# EAGLE schematic Mtx6BR_V2 (EAGLE 7.5.0)
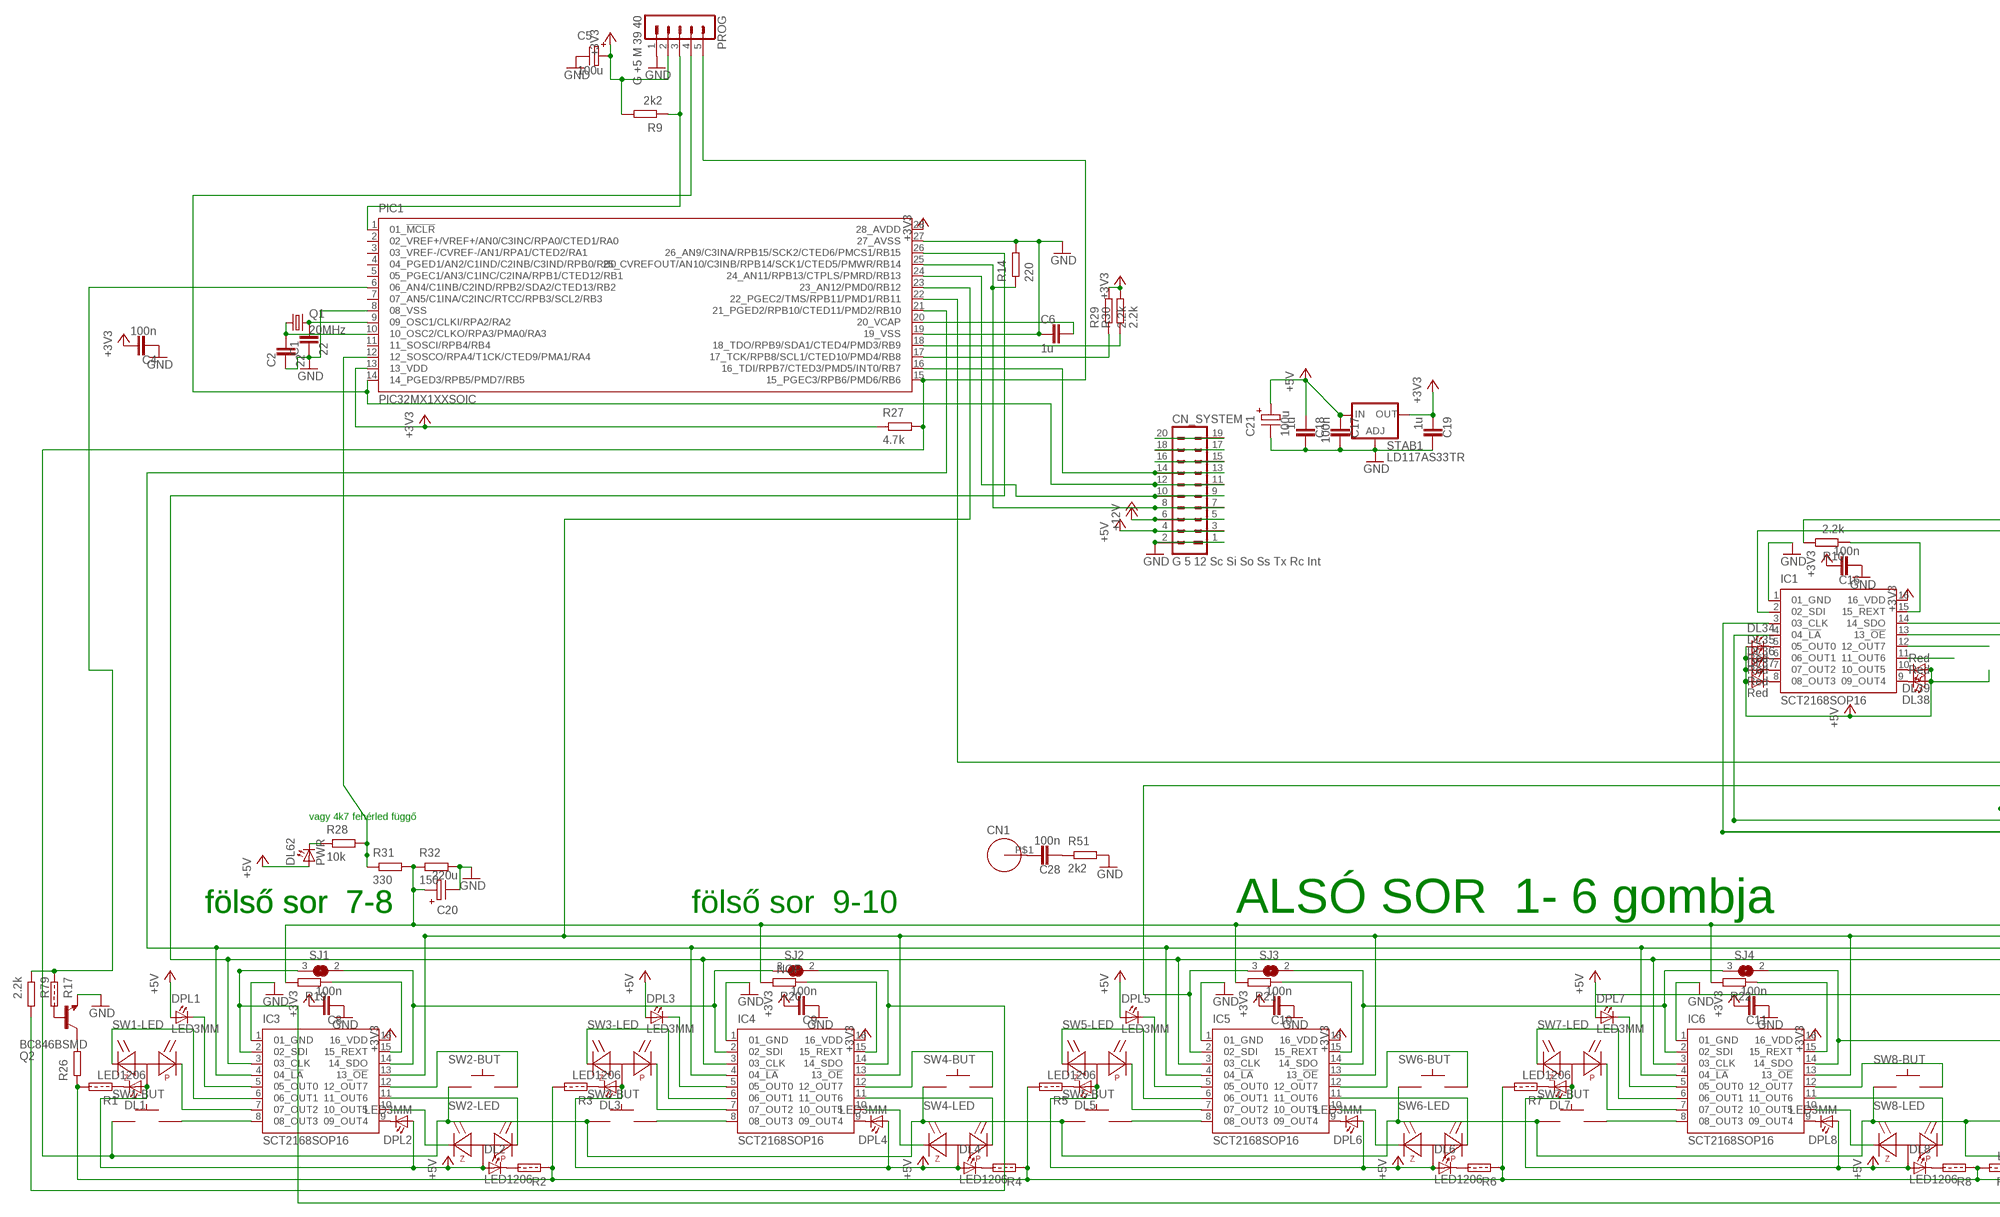
[diagram p0: schematic, sheet 1, part 1 of 2]
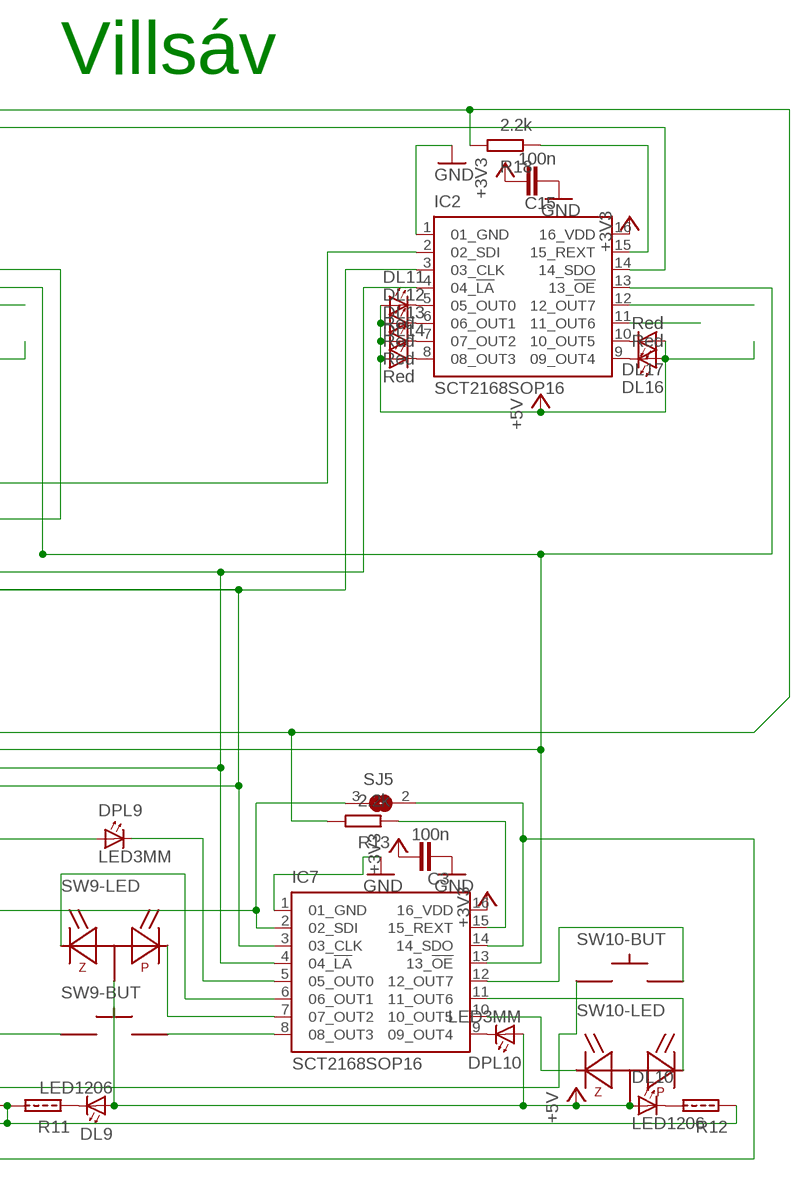
[diagram p1: schematic, sheet 1, part 2 of 2]

## Parts
C1  22  C0805  [R0805]
C2  22  C0805  [R0805]
C3  100n  C0805  [R0805]
C4  100n  C0805  [R0805]
C5  100u  C_EL1R07  [C_EL1RASZT07]
C6  1u  C0805  [R0805]
C8  100n  C0805  [R0805]
C9  100n  C0805  [R0805]
C10  100n  C0805  [R0805]
C11  100n  C0805  [R0805]
C15  100n  C0805  [R0805]
C16  100n  C0805  [R0805]
C17  100n  C0805  [R0805]
C18  1u  C0805  [R0805]
C19  1u  C0805  [R0805]
C20  220u  C_EL1R07  [C_EL1RASZT07]
C21  100u  C_EL1R07  [C_EL1RASZT07]
C28  100n  C0805  [R0805]
CN1  TESTCSAVAR3.5  [TESTCSAVAR_3.5]
CN_SYSTEM  G 5 12 Sc Si So Ss Tx Rc Int  PIN10_2  [PIN10_2]
DL1  LED1206  [R1206]
DL2  LED1206  [R1206]
DL3  LED1206  [R1206]
DL4  LED1206  [R1206]
DL5  LED1206  [R1206]
DL6  LED1206  [R1206]
DL7  LED1206  [R1206]
DL8  LED1206  [R1206]
DL9  LED1206  [R1206]
DL10  LED1206  [R1206]
DL11  Red  LED5MM  [LED5MM]
DL12  Red  LED5MM  [LED5MM]
DL13  Red  LED5MM  [LED5MM]
DL14  Red  LED5MM  [LED5MM]
DL16  Red  LED5MM  [LED5MM]
DL17  Red  LED5MM  [LED5MM]
DL34  Red  LED5MM  [LED5MM]
DL35  Red  LED5MM  [LED5MM]
DL36  Red  LED5MM  [LED5MM]
DL37  Red  LED5MM  [LED5MM]
DL38  Red  LED5MM  [LED5MM]
DL39  Red  LED5MM  [LED5MM]
DL62  PWR  LED5MM  [LED5MM]
DPL1  LED3MM  [LED3MM]
DPL2  LED3MM  [LED3MM]
DPL3  LED3MM  [LED3MM]
DPL4  LED3MM  [LED3MM]
DPL5  LED3MM  [LED3MM]
DPL6  LED3MM  [LED3MM]
DPL7  LED3MM  [LED3MM]
DPL8  LED3MM  [LED3MM]
DPL9  LED3MM  [LED3MM]
DPL10  LED3MM  [LED3MM]
IC1  SCT2168SOP16  [SO16]
IC2  SCT2168SOP16  [SO16]
IC3  SCT2168SOP16  [SO16]
IC4  SCT2168SOP16  [SO16]
IC5  SCT2168SOP16  [SO16]
IC6  SCT2168SOP16  [SO16]
IC7  SCT2168SOP16  [SO16]
PIC1  PIC32MX1XXSOIC  [SOIC127P1032X265-28N]
PROG  G +5 M 39 40  PIN05_1  [PIN05_1]
Q1  20MHz  XTAL_2NAGYSMD  [XTAL_NAGYSMD]
Q2  BC846BSMD  [SOT23]
R1  RNULL_EU0805  [R0805_C]
R2  RNULL_EU0805  [R0805_C]
R3  RNULL_EU0805  [R0805_C]
R4  RNULL_EU0805  [R0805_C]
R5  RNULL_EU0805  [R0805_C]
R6  RNULL_EU0805  [R0805_C]
R7  RNULL_EU0805  [R0805_C]
R8  RNULL_EU0805  [R0805_C]
R9  2k2  R_EU0805  [R0805]
R10  2.2k  R_EU0805  [R0805]
R11  RNULL_EU0805  [R0805_C]
R12  RNULL_EU0805  [R0805_C]
R13  2.2k  R_EU0805  [R0805]
R14  220  R_EU0805  [R0805]
R17  RNULL_EU0805  [R0805_C]
R18  2.2k  R_EU0805  [R0805]
R19  R_EU0805  [R0805]
R20  NOP  R_EU0805  [R0805]
R21  R_EU0805  [R0805]
R22  R_EU0805  [R0805]
R26  R_EU0805  [R0805]
R27  4.7k  R_EU0805  [R0805]
R28  10k  R_EU0805  [R0805]
R29  2.2k  R_EU0805  [R0805]
R30  2.2k  R_EU0805  [R0805]
R31  330  R_EU0805  [R0805]
R32  150  R_EU0805  [R0805]
R51  2k2  R_EU0805  [R0805]
R79  2.2k  R_EU0805  [R0805]
SJ1  SJ  [SJ]
SJ2  SJ  [SJ]
SJ3  SJ  [SJ]
SJ4  SJ  [SJ]
SJ5  SJ  [SJ]
STAB1  LD117AS33TR  [SOT223]
SW1  SPG2  [SPG2_3LED]
SW2  SPG2  [SPG2_3LED]
SW3  SPG2  [SPG2_3LED]
SW4  SPG2  [SPG2_3LED]
SW5  SPG2  [SPG2_3LED]
SW6  SPG2  [SPG2_3LED]
SW7  SPG2  [SPG2_3LED]
SW8  SPG2  [SPG2_3LED]
SW9  SPG2  [SPG2_3LED]
SW10  SPG2  [SPG2_3LED]

## Nets
+3V3: C3.1 C4.1 C5.P+ C8.1 C9.1 C10.1 C11.1 C15.1 C16.1 C19.2 IC1.16(16_VDD) IC2.16(16_VDD) IC3.16(16_VDD) IC4.16(16_VDD) IC5.16(16_VDD) IC6.16(16_VDD) IC7.16(16_VDD) PIC1.13(13_VDD) PIC1.28(28_AVDD) PROG.2 R9.2(E) R27.1(A) R29.2(E) R30.2(E) STAB1.4(OUT)
+5V: C17.2 C18.2 C21.P+ CN_SYSTEM.3 CN_SYSTEM.4 DL1.1(A) DL2.1(A) DL3.1(A) DL4.1(A) DL5.1(A) DL6.1(A) DL7.1(A) DL8.1(A) DL9.1(A) DL10.1(A) DL11.A DL12.A DL13.A DL14.A DL16.A DL17.A DL34.A DL35.A DL36.A DL37.A DL38.A DL39.A DL62.A DPL1.A DPL2.A DPL3.A DPL4.A DPL5.A DPL6.A DPL7.A DPL8.A DPL9.A DPL10.A STAB1.3(IN) SW1.LED+(-LED:+) SW2.LED+(-LED:+) SW3.LED+(-LED:+) SW4.LED+(-LED:+) SW5.LED+(-LED:+) SW6.LED+(-LED:+) SW7.LED+(-LED:+) SW8.LED+(-LED:+) SW9.LED+(-LED:+) SW10.LED+(-LED:+)
+12V: CN_SYSTEM.5 CN_SYSTEM.6
GND [Tap]: C1.2 C2.2 C3.2 C4.2 C5.P- C6.2 C8.2 C9.2 C10.2 C11.2 C15.2 C16.2 C17.1 C18.1 C19.1 C20.P- C21.P- CN_SYSTEM.1 CN_SYSTEM.2 IC1.1(01_GND) IC2.1(01_GND) IC3.1(01_GND) IC4.1(01_GND) IC5.1(01_GND) IC6.1(01_GND) IC7.1(01_GND) PIC1.8(08_VSS) PIC1.19(19_VSS) PIC1.27(27_AVSS) PROG.1 Q2.2(E) R14.2(E) R32.2(E) R51.2(E) STAB1.1(ADJ)
N$1: C1.1 PIC1.9(09_OSC1/CLKI/RPA2/RA2) Q1.P$2
N$2: C2.1 PIC1.10(10_OSC2/CLKO/RPA3/PMA0/RA3) Q1.P$1
N$3: C20.P+ R10.2(E) R13.2(E) R18.2(E) R19.2(E) R20.2(E) R21.2(E) R22.2(E) R31.2(E) R32.1(A)
N$4: IC5.8(08_OUT3) SW5.G2(-BUT:G2)
N$5: IC7.7(07_OUT2) SW9.P-(-LED:P)
N$6: DL34.K(C) IC1.5(05_OUT0)
N$7: IC5.7(07_OUT2) SW5.P-(-LED:P)
N$8: DL35.K(C) IC1.6(06_OUT1)
N$9: Q2.1(B) R17.2(E)
N$10: IC5.10(10_OUT5) SW6.Z-(-LED:Z)
N$11: IC5.6(06_OUT1) SW5.Z-(-LED:Z)
N$12: IC5.11(11_OUT6) SW6.P-(-LED:P)
N$13: IC7.6(06_OUT1) SW9.Z-(-LED:Z)
N$14: IC5.12(12_OUT7) SW6.G2(-BUT:G2)
N$15: IC7.10(10_OUT5) SW10.Z-(-LED:Z)
N$16: IC7.11(11_OUT6) SW10.P-(-LED:P)
N$17: DPL5.K(C) IC5.5(05_OUT0)
N$18: DL6.2(C) R6.2(E)
N$19: DPL6.K(C) IC5.9(09_OUT4)
N$20: DL5.2(C) R5.1(A)
N$21: IC2.15(15_REXT) R18.1(A)
N$22: IC7.12(12_OUT7) SW10.G2(-BUT:G2)
N$23: DL1.2(C) R1.1(A)
N$24: DPL2.K(C) IC3.9(09_OUT4)
N$25: DL2.2(C) R2.2(E)
N$26: IC7.8(08_OUT3) SW9.G2(-BUT:G2)
N$27: IC4.7(07_OUT2) SW3.P-(-LED:P)
N$28: IC4.6(06_OUT1) SW3.Z-(-LED:Z)
N$29: IC3.7(07_OUT2) SW1.P-(-LED:P)
N$30: IC3.6(06_OUT1) SW1.Z-(-LED:Z)
N$31: IC3.10(10_OUT5) SW2.Z-(-LED:Z)
N$32: IC3.11(11_OUT6) SW2.P-(-LED:P)
N$33: PIC1.6(06_AN4/C1INB/C2IND/RPB2/SDA2/CTED13/RB2) R17.1(A) R79.1(A)
N$34: DL62.K(C) R28.1(A)
N$35: PIC1.18(18_TDO/RPB9/SDA1/CTED4/PMD3/RB9) R30.1(A)
N$36: PIC1.17(17_TCK/RPB8/SCL1/CTED10/PMD4/RB8) R29.1(A)
N$37: IC1.15(15_REXT) R10.1(A)
N$38: DL36.K(C) IC1.7(07_OUT2)
N$39: DL37.K(C) IC1.8(08_OUT3)
N$40: DL38.K(C) IC1.9(09_OUT4)
N$41: PIC1.1(01_!MCLR!) PROG.3 R9.1(A)
N$42: CN_SYSTEM.15 CN_SYSTEM.16
N$43: IC3.12(12_OUT7) SW2.G2(-BUT:G2)
N$44: CN_SYSTEM.17 CN_SYSTEM.18
N$45: CN_SYSTEM.19 CN_SYSTEM.20
N$46: DL39.K(C) IC1.10(10_OUT5)
N$47: DPL9.K(C) IC7.5(05_OUT0)
N$48: DPL10.K(C) IC7.9(09_OUT4)
N$49: IC6.14(14_SDO) IC7.2(02_SDI) SJ4.2 SJ5.3
N$50: IC3.8(08_OUT3) SW1.G2(-BUT:G2)
N$51: DL10.2(C) R12.2(E)
N$52: IC2.11(11_OUT6)
N$53: IC2.2(02_SDI) PIC1.22(22_PGEC2/TMS/RPB11/PMD1/RB11)
N$54: IC1.2(02_SDI) IC2.14(14_SDO)
N$55: IC2.12(12_OUT7)
N$56: DL9.2(C) R11.1(A)
N$57: IC3.2(02_SDI) IC7.14(14_SDO) SJ1.3 SJ5.2
N$58: DPL1.K(C) IC3.5(05_OUT0)
N$59: IC4.10(10_OUT5) SW4.Z-(-LED:Z)
N$60: IC7.15(15_REXT) R13.1(A)
N$61: DL11.K(C) IC2.5(05_OUT0)
N$62: C6.1 PIC1.20(20_VCAP)
N$63: IC3.14(14_SDO) IC4.2(02_SDI) SJ1.2 SJ2.3
N$64: IC4.11(11_OUT6) SW4.P-(-LED:P)
N$65: IC4.12(12_OUT7) SW4.G2(-BUT:G2)
N$66: IC4.8(08_OUT3) SW3.G2(-BUT:G2)
N$67: DPL3.K(C) IC4.5(05_OUT0)
N$68: IC1.12(12_OUT7)
N$69: IC1.11(11_OUT6)
N$70: IC6.7(07_OUT2) SW7.P-(-LED:P)
N$71: Q2.3(C) R26.2(E)
N$72: PIC1.12(12_SOSCO/RPA4/T1CK/CTED9/PMA1/RA4) R28.2(E) R31.1(A)
N$73: DL12.K(C) IC2.6(06_OUT1)
N$74: IC6.6(06_OUT1) SW7.Z-(-LED:Z)
N$75: IC6.10(10_OUT5) SW8.Z-(-LED:Z)
N$76: IC6.11(11_OUT6) SW8.P-(-LED:P)
N$77: IC6.12(12_OUT7) SW8.G2(-BUT:G2)
N$78: IC6.8(08_OUT3) SW7.G2(-BUT:G2)
N$79: DPL7.K(C) IC6.5(05_OUT0)
N$80: C28.1 CN1.P$1
N$81: IC4.14(14_SDO) R79.2(E) SJ2.2
N$82: DPL4.K(C) IC4.9(09_OUT4)
N$83: DL3.2(C) R3.1(A)
N$84: DL4.2(C) R4.2(E)
N$85: IC3.15(15_REXT) R19.1(A)
N$86: DL13.K(C) IC2.7(07_OUT2)
N$87: IC4.15(15_REXT) R20.1(A)
N$88: IC5.15(15_REXT) R21.1(A)
N$89: IC6.15(15_REXT) R22.1(A)
N$90: DL14.K(C) IC2.8(08_OUT3)
N$91: DL16.K(C) IC2.9(09_OUT4)
N$92: DL17.K(C) IC2.10(10_OUT5)
N$99: DPL8.K(C) IC6.9(09_OUT4)
N$100: DL7.2(C) R7.1(A)
N$101: DL8.2(C) R8.2(E)
N$130: C28.2 R51.1(A)
N$158: IC5.14(14_SDO) IC6.2(02_SDI) SJ3.2 SJ4.3
N$334: R1.2(E) R2.1(A) R3.2(E) R4.1(A) R5.2(E) R6.1(A) R7.2(E) R8.1(A) R11.2(E) R12.1(A) R26.1(A)
N$369: IC1.13(13_!OE!) IC2.13(13_!OE!) IC3.13(13_!OE!) IC4.13(13_!OE!) IC5.13(13_!OE!) IC6.13(13_!OE!) IC7.13(13_!OE!) PIC1.23(23_AN12/PMD0/RB12)
SCK1: CN_SYSTEM.7 CN_SYSTEM.8 PIC1.25(25_CVREFOUT/AN10/C3INB/RPB14/SCK1/CTED5/PMWR/RB14) R14.1(A)
SCK3: IC1.3(03_CLK) IC2.3(03_CLK) IC3.3(03_CLK) IC4.3(03_CLK) IC5.3(03_CLK) IC6.3(03_CLK) IC7.3(03_CLK) PIC1.26(26_AN9/C3INA/RPB15/SCK2/CTED6/PMCS1/RB15)
SDI1: CN_SYSTEM.11 CN_SYSTEM.12 PIC1.14(14_PGED3/RPB5/PMD7/RB5) PROG.4
SDI3: PIC1.15(15_PGEC3/RPB6/PMD6/RB6) PROG.5 R27.2(E) SW1.G1(-BUT:G1) SW2.G1(-BUT:G1) SW3.G1(-BUT:G1) SW4.G1(-BUT:G1) SW5.G1(-BUT:G1) SW6.G1(-BUT:G1) SW7.G1(-BUT:G1) SW8.G1(-BUT:G1) SW9.G1(-BUT:G1) SW10.G1(-BUT:G1)
SDO1: CN_SYSTEM.9 CN_SYSTEM.10 PIC1.24(24_AN11/RPB13/CTPLS/PMRD/RB13)
SDO2: IC1.14(14_SDO) IC5.2(02_SDI) SJ3.3
SS1: CN_SYSTEM.13 CN_SYSTEM.14 PIC1.16(16_TDI/RPB7/CTED3/PMD5/INT0/RB7)
SS3: IC1.4(04_!LA!) IC2.4(04_!LA!) IC3.4(04_!LA!) IC4.4(04_!LA!) IC5.4(04_!LA!) IC6.4(04_!LA!) IC7.4(04_!LA!) PIC1.21(21_PGED2/RPB10/CTED11/PMD2/RB10)
Unconnected: PIC1.2(02_VREF+/VREF+/AN0/C3INC/RPA0/CTED1/RA0) PIC1.3(03_VREF-/CVREF-/AN1/RPA1/CTED2/RA1) PIC1.4(04_PGED1/AN2/C1IND/C2INB/C3IND/RPB0/RB0) PIC1.5(05_PGEC1/AN3/C1INC/C2INA/RPB1/CTED12/RB1) PIC1.7(07_AN5/C1INA/C2INC/RTCC/RPB3/SCL2/RB3) PIC1.11(11_SOSCI/RPB4/RB4)

## Notes on the sheet
- Villsáv
- vagy 4k7 fehérled függő
- fölső sor  7-8 | fölső sor  7-8 | fölső sor  9-10 | ALSÓ SOR  1- 6 gombja

## Library data of the parts
C1-C4 C6 C8-C11 C15-C19 C28 = Cf_RLCPX:C
C5 C20 C21 = Cf_RLCPX:C_EL
CN1 = Cf_Csatl:TESTCSAVAR
CN_SYSTEM = Cf_Csatl:PIN10_2
DL1-DL14 DL16 DL17 DL34-DL39 DL62 DPL1-DPL10 = Cf_Felv:LED
IC1-IC7 = Cf_IC:SCT2168
PIC1 = Narvalex:PIC32MX1XX
PROG = Cf_Csatl:PIN05_1
Q1 = Cf_RLCPX:XTAL_2
Q2 = narval:BC846*: NPN Transistor
R1-R8 R11 R12 R17 = Cf_RLCPX:RNULL_EU
R9 R10 R13 R14 R18-R22 R26-R32 R51 R79 = Cf_RLCPX:R_EU
SJ1-SJ5 = jumper:SJ: SMD solder JUMPER
STAB1 = narval:LD117A?*: Low drop fixed and adjustable positive voltage regulators 1 A Source: http://www.st.com/stonline/products/literature/ds/7194/ld1117axx.pdf
SW1-SW10 = narval:SPG2

## Net classes
0 default: width 0.305 mm, clearance 0.305 mm
1 Tap: width 0.406 mm, clearance 0.305 mm